# Altium schematic sheet Power_main_DCDC.SchDoc: =DocumentName
size A4; DocumentNumber: 1; Revision: 0; SheetNumber: 4; SheetTotal: 18
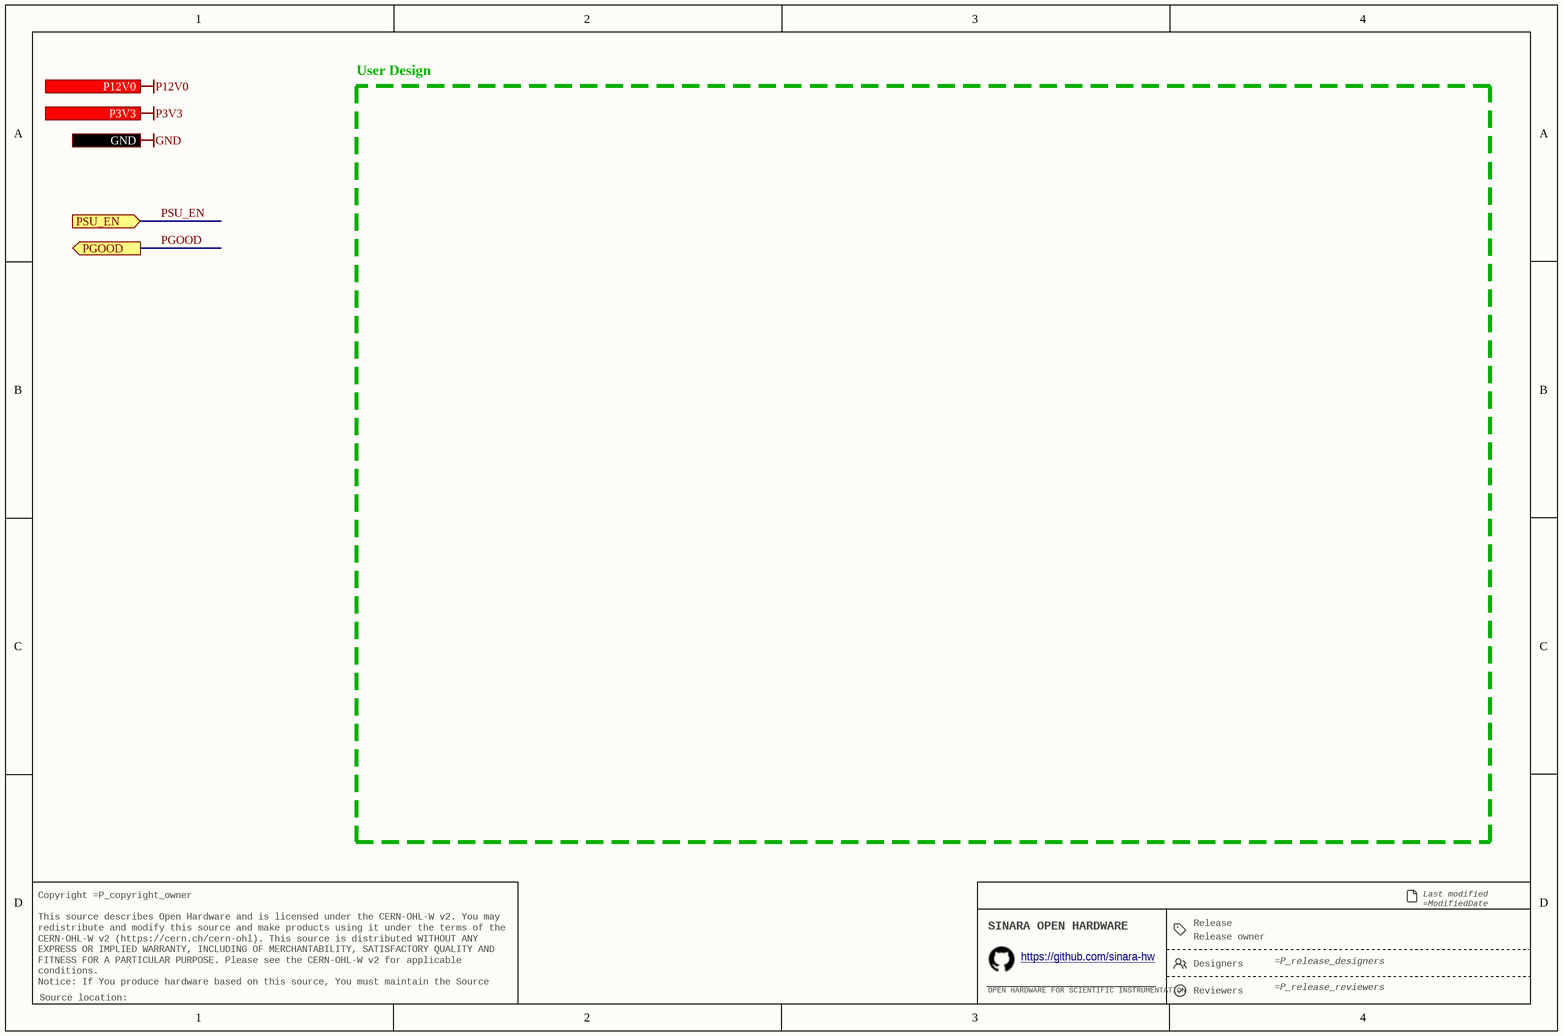
[diagram p0: Power_main_DCDC.SchDoc]

## Ports
GND, P3V3 (out), P12V0 (in), PGOOD (out), PSU_EN (in)

## Nets
GND: port GND
P3V3: port P3V3
P12V0: port P12V0
PGOOD: port PGOOD
PSU_EN: port PSU_EN

## Notes on the sheet
- User Design
- Release
- Last modified =ModifiedDate
  Sheet =sheetnumber of =sheettotal · Size A4
- Copyright =P_copyright_owner
  This source describes Open Hardware and is licensed under the CERN-OHL-W v2. You may redistribute and modify this source and make products using it under the terms of the CERN-OHL-W v2 (https://cern.ch/cern-ohl). This source is distributed WITHOUT ANY EXPRESS OR IMPLIED WARRANTY, INCLUDING OF MERCHANTABILITY, SATISFACTORY QUALITY AND FITNESS FOR A PARTICULAR PURPOSE. Please see the CERN-OHL-W v2 for applicable conditions.
  Notice: If You produce hardware based on this source, You must maintain the Source Location visible on the product, its packaging or its documentation.
- SINARA OPEN HARDWARE
- OPEN HARDWARE FOR SCIENTIFIC INSTRUMENTATION
- https://github.com/sinara-hw
- Release owner
- Designers
- Reviewers
- Source location: